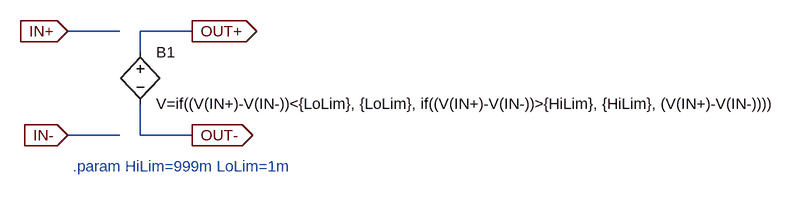
[diagram p0: schematic VLimit.asc]
VLimit.asc, the LTspice schematic file:
Version 4
SHEET 1 1276 680
WIRE 128 208 48 208
WIRE 240 208 160 208
WIRE 160 240 160 208
WIRE 128 368 48 368
WIRE 160 368 160 320
WIRE 240 368 160 368
FLAG 48 368 IN-
IOPIN 48 368 In
FLAG 240 208 OUT+
IOPIN 240 208 Out
FLAG 48 208 IN+
IOPIN 48 208 In
FLAG 240 368 OUT-
IOPIN 240 368 Out
SYMBOL bv 160 224 R0
SYMATTR InstName B1
SYMATTR Value V=if((V(IN+)-V(IN-))<{LoLim}, {LoLim}, if((V(IN+)-V(IN-))>{HiLim}, {HiLim}, (V(IN+)-V(IN-))))
TEXT 56 416 Left 0 ;.param HiLim=999m LoLim=1m

The netlist it stands for:
* VLimit.asc
B1 OUT+ OUT- V=if((V(IN+)-V(IN-))<{LoLim}, {LoLim}, if((V(IN+)-V(IN-))>{HiLim}, {HiLim}, (V(IN+)-V(IN-))))
* .param HiLim=999m LoLim=1m
.backanno
.end